# EAGLE schematic clock_datapath (EAGLE 9.6.1)
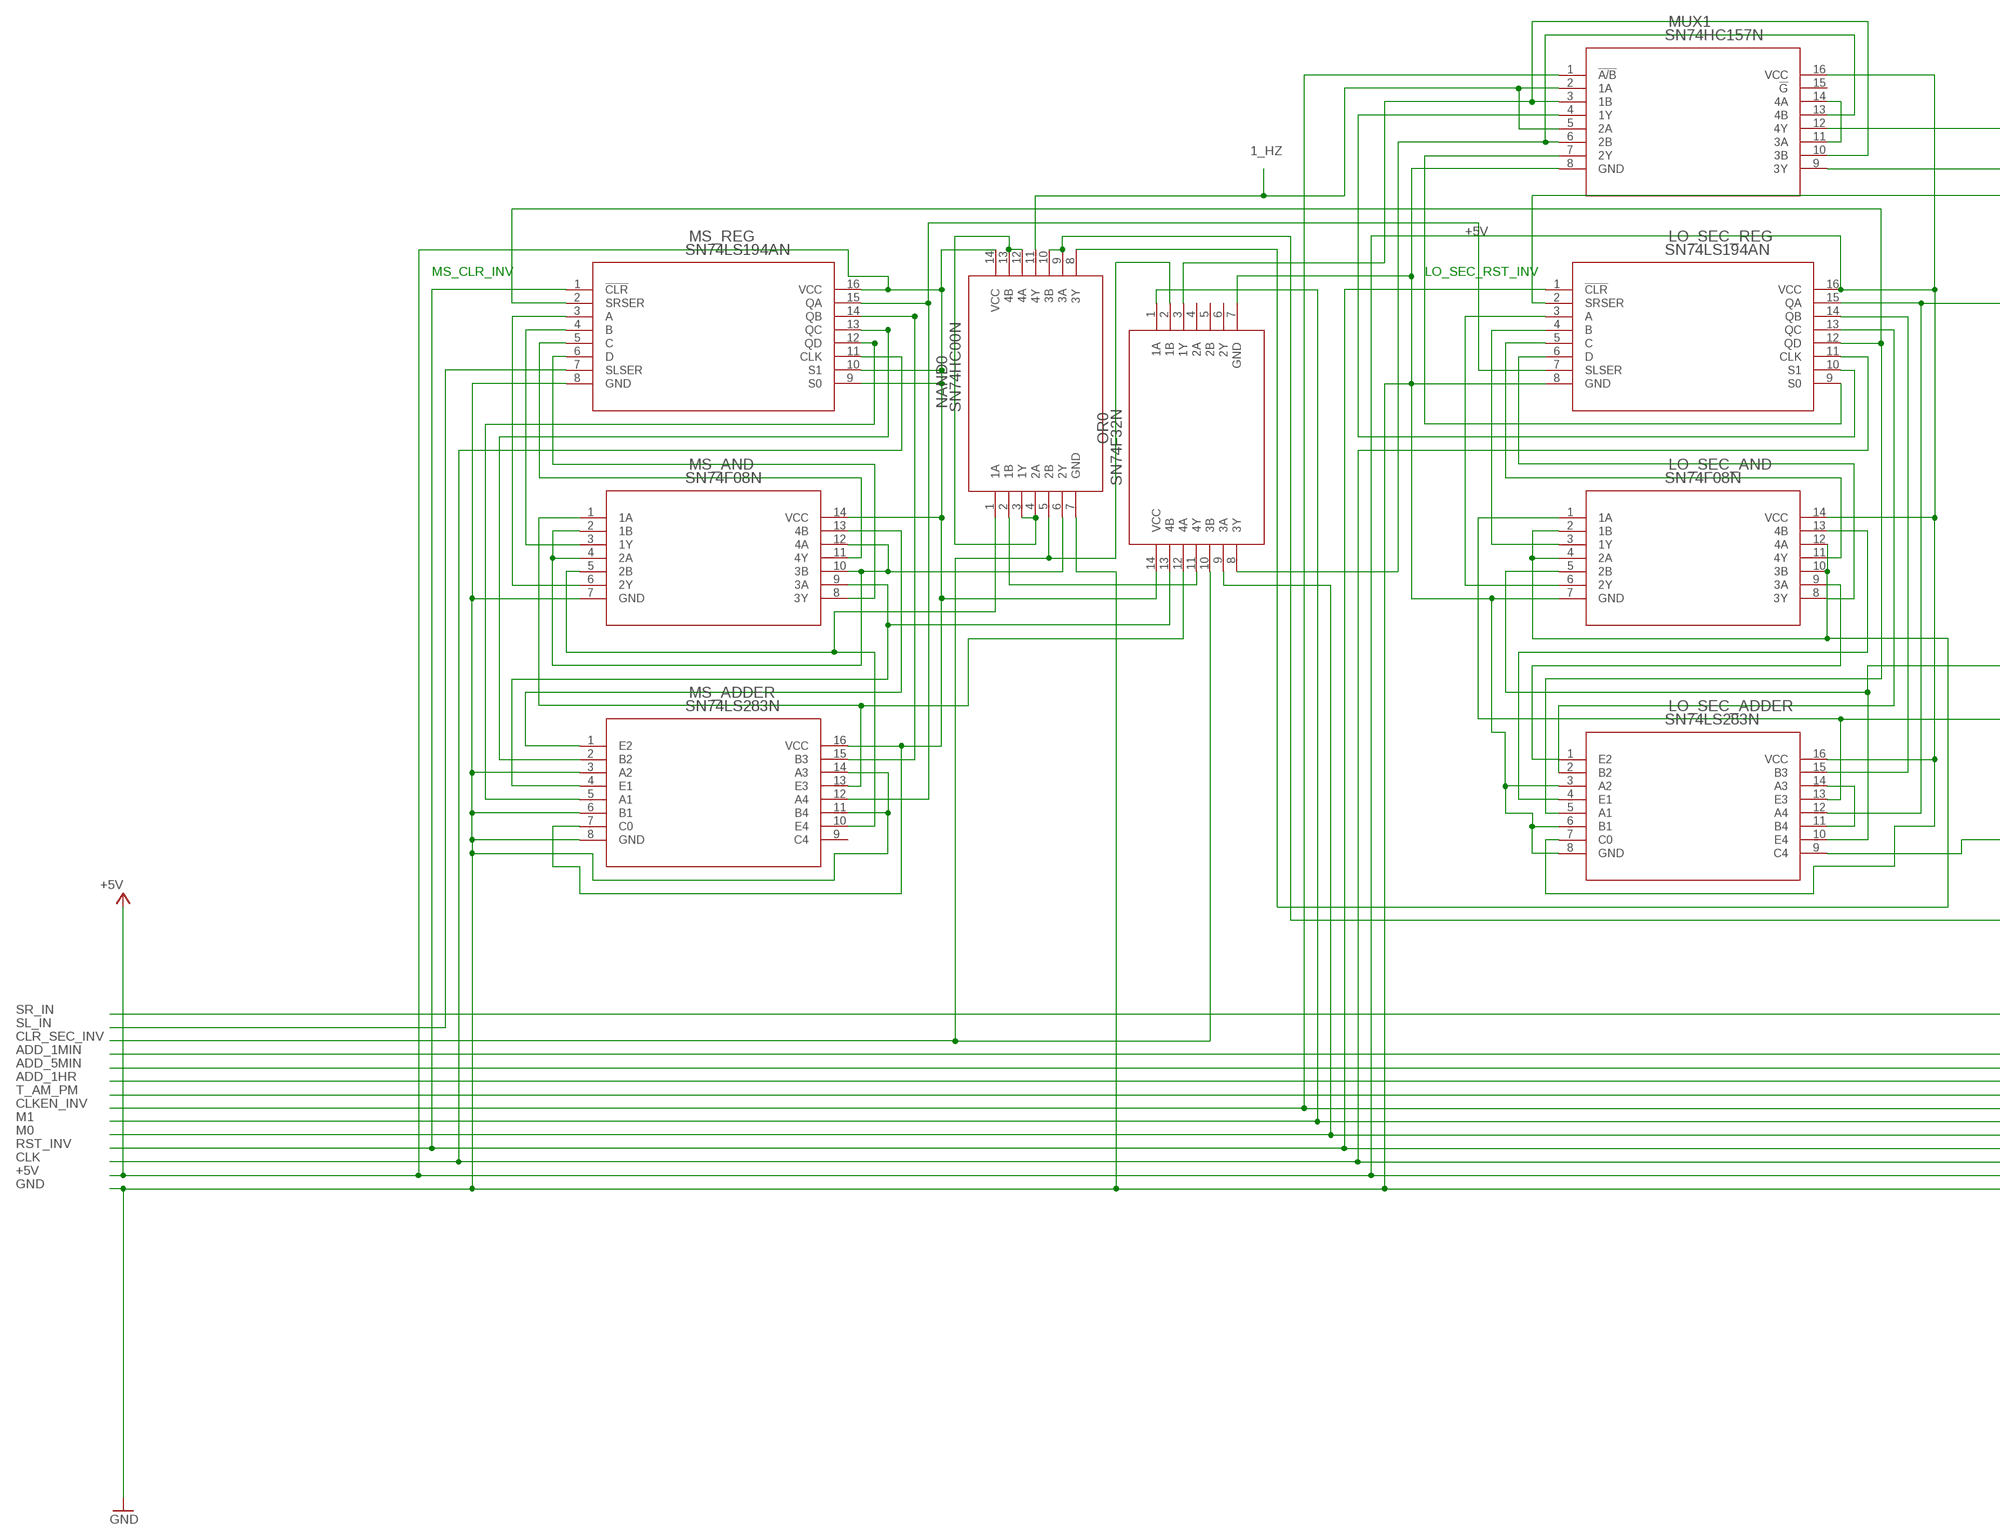
[diagram p0: schematic, sheet 1, part 1 of 3]
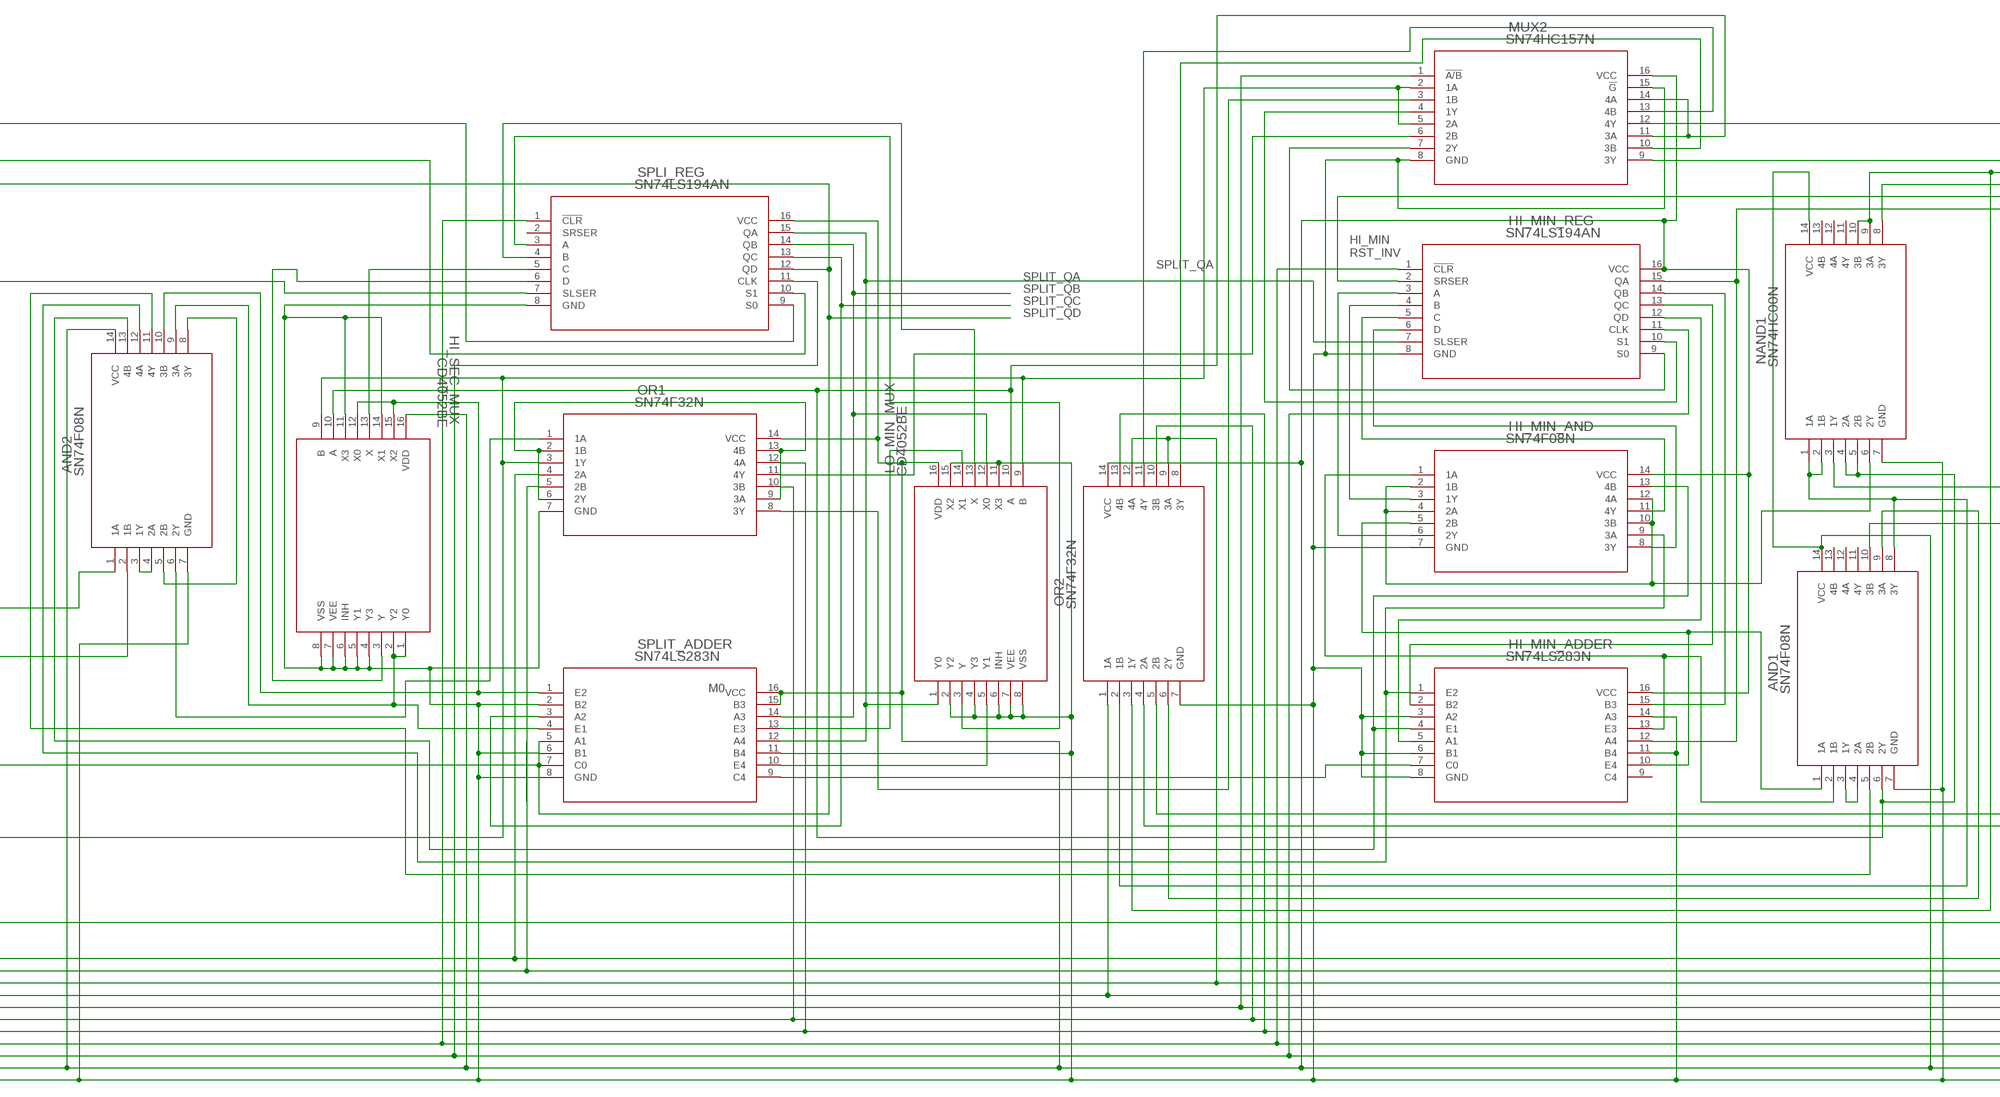
[diagram p1: schematic, sheet 1, part 2 of 3]
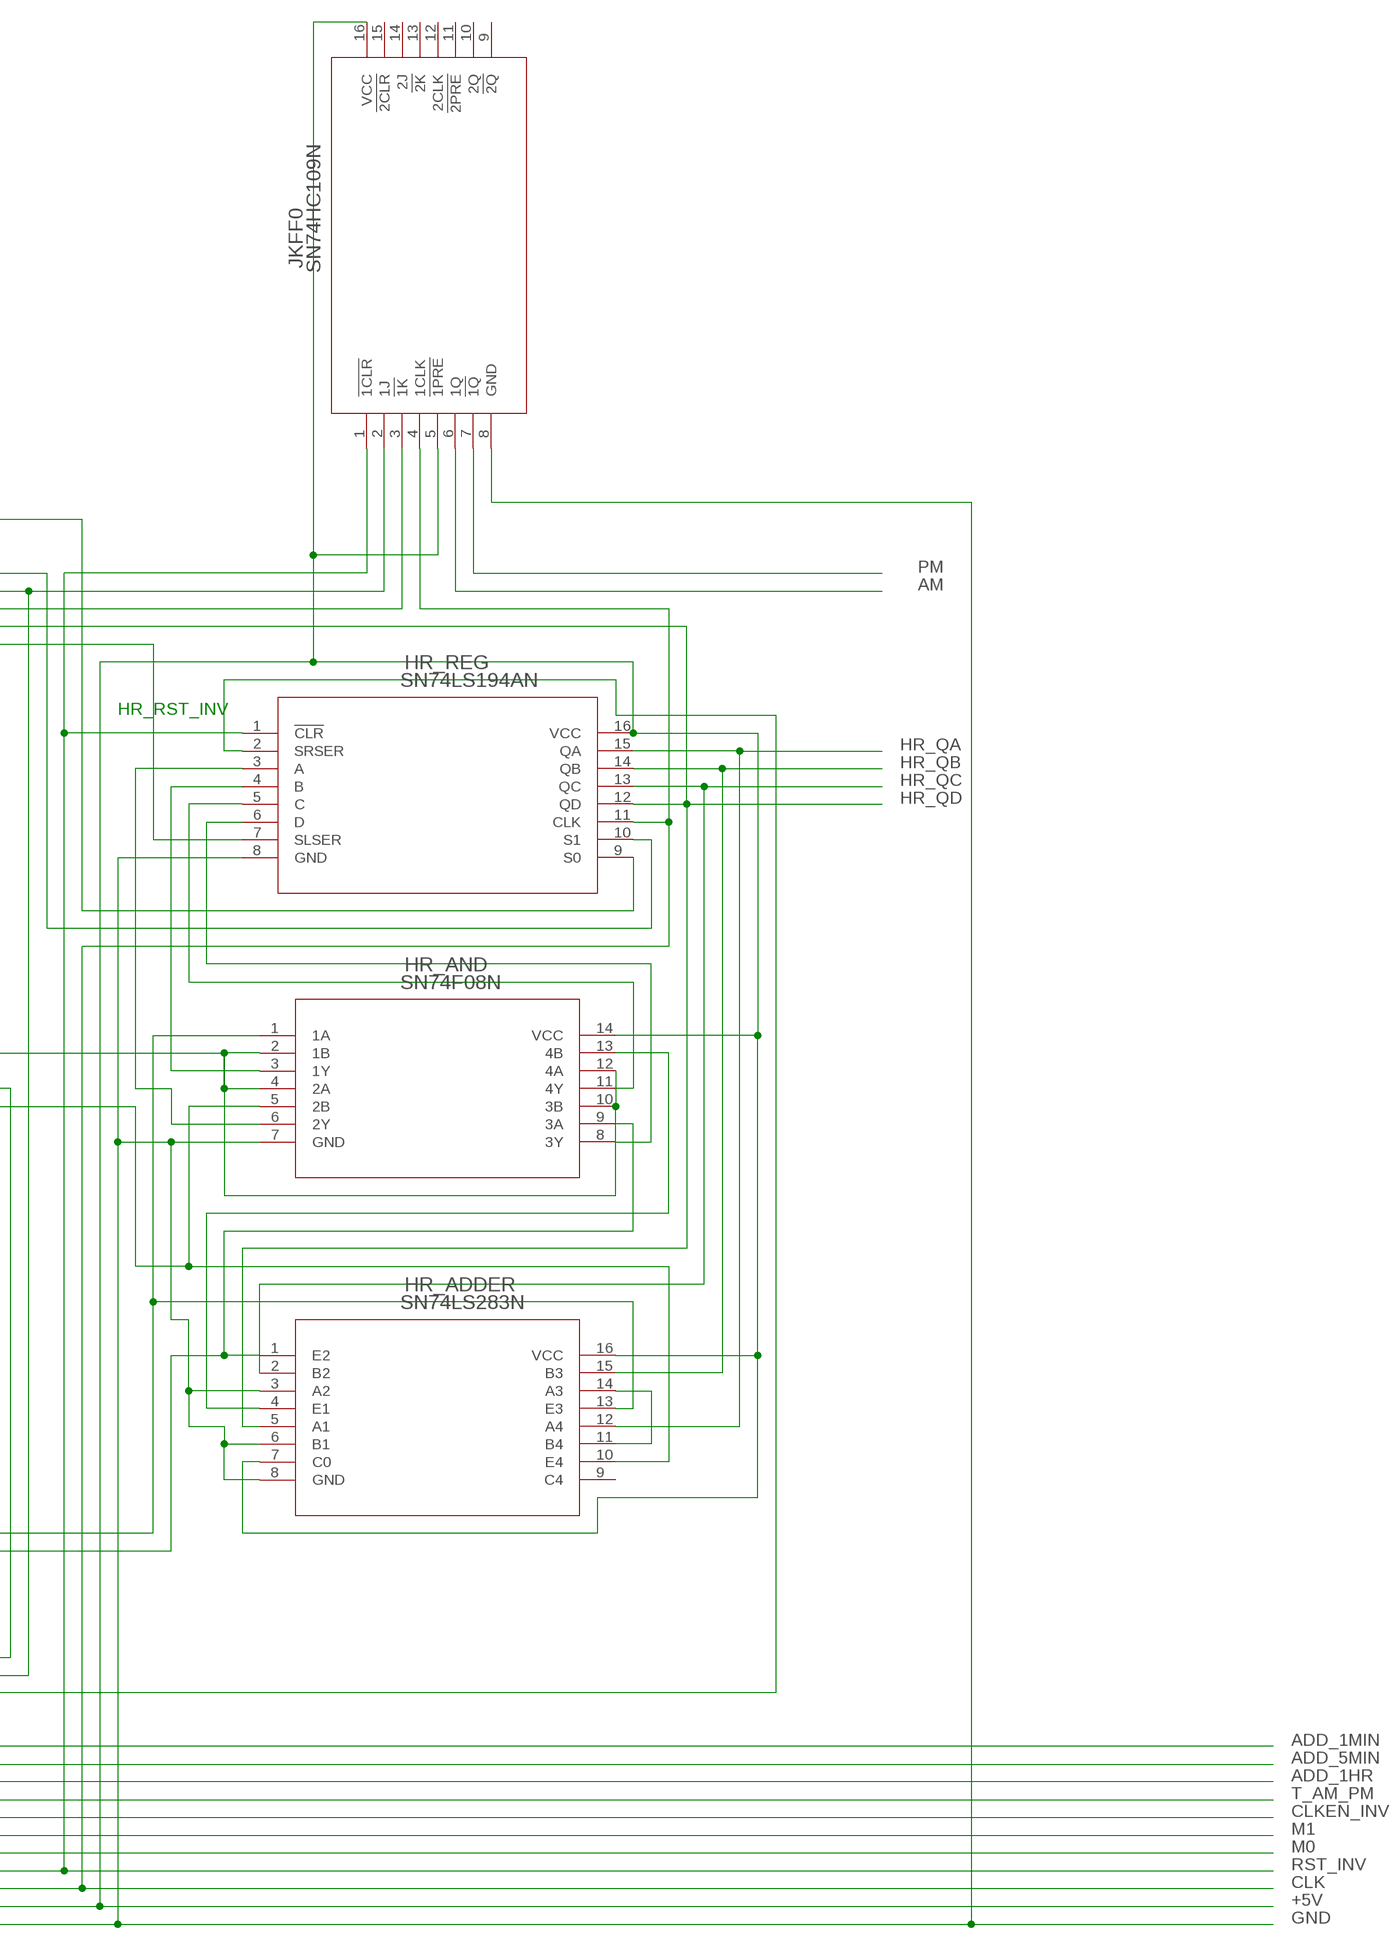
[diagram p2: schematic, sheet 1, part 3 of 3]

## Parts
AND1  SN74F08N  [N14]
AND2  SN74F08N  [N14]
HI_MIN_ADDER  SN74LS283N  [N16]
HI_MIN_AND  SN74F08N  [N14]
HI_MIN_REG  SN74LS194AN  [N16]
HI_SEC_MUX  CD4052BE  [N16]
HR_ADDER  SN74LS283N  [N16]
HR_AND  SN74F08N  [N14]
HR_REG  SN74LS194AN  [N16]
JKFF0  SN74HC109N  [N16]
LO_MIN_MUX  CD4052BE  [N16]
LO_SEC_ADDER  SN74LS283N  [N16]
LO_SEC_AND  SN74F08N  [N14]
LO_SEC_REG  SN74LS194AN  [N16]
MS_ADDER  SN74LS283N  [N16]
MS_AND  SN74F08N  [N14]
MS_REG  SN74LS194AN  [N16]
MUX1  SN74HC157N  [N16]
MUX2  SN74HC157N  [N16]
NAND0  SN74HC00N  [N14]
NAND1  SN74HC00N  [N14]
OR0  SN74F32N  [N14]
OR1  SN74F32N  [N14]
OR2  SN74F32N  [N14]
SPLI_REG  SN74LS194AN  [N16]
SPLIT_ADDER  SN74LS283N  [N16]

## Nets
1_HZ: MUX1.2(1A) MUX1.5(2A) NAND0.11(4Y)
+5V: AND1.14(VCC) AND2.14(VCC) HI_MIN_ADDER.16(VCC) HI_MIN_AND.14(VCC) HI_MIN_REG.16(VCC) HI_SEC_MUX.16(VDD) HR_ADDER.7(C0) HR_ADDER.16(VCC) HR_AND.14(VCC) HR_REG.16(VCC) JKFF0.5(!1PRE) JKFF0.16(VCC) LO_MIN_MUX.16(VDD) LO_SEC_ADDER.7(C0) LO_SEC_ADDER.16(VCC) LO_SEC_AND.14(VCC) LO_SEC_REG.16(VCC) MS_ADDER.7(C0) MS_ADDER.16(VCC) MS_AND.14(VCC) MS_REG.9(S0) MS_REG.10(S1) MS_REG.16(VCC) MUX1.16(VCC) MUX2.16(VCC) NAND0.14(VCC) NAND1.14(VCC) OR0.14(VCC) OR1.14(VCC) OR2.14(VCC) SPLI_REG.16(VCC) SPLIT_ADDER.15(B3) SPLIT_ADDER.16(VCC)
ADD_1HR: OR2.9(3A) OR2.12(4A)
ADD_1MIN: OR1.4(2A)
ADD_5MIN: OR1.5(2B)
AM: JKFF0.6(1Q)
CLK: HI_MIN_REG.11(CLK) HR_REG.11(CLK) JKFF0.4(1CLK) LO_SEC_REG.11(CLK) MS_REG.11(CLK) SPLI_REG.11(CLK)
CLKEN_INV: MUX1.1(!A/B) MUX2.1(!A/B)
CLR_SEC_INV: NAND0.5(2B) OR0.2(1B) OR0.10(3B)
GND: AND1.7(GND) AND2.7(GND) HI_MIN_ADDER.3(A2) HI_MIN_ADDER.6(B1) HI_MIN_ADDER.8(GND) HI_MIN_ADDER.11(B4) HI_MIN_ADDER.14(A3) HI_MIN_AND.7(GND) HI_MIN_REG.8(GND) HI_SEC_MUX.4(Y3) HI_SEC_MUX.5(Y1) HI_SEC_MUX.6(INH) HI_SEC_MUX.7(VEE) HI_SEC_MUX.8(VSS) HI_SEC_MUX.11(X3) HI_SEC_MUX.14(X1) HR_ADDER.3(A2) HR_ADDER.6(B1) HR_ADDER.8(GND) HR_AND.7(GND) HR_REG.8(GND) JKFF0.8(GND) LO_MIN_MUX.2(Y2) LO_MIN_MUX.4(Y3) LO_MIN_MUX.6(INH) LO_MIN_MUX.7(VEE) LO_MIN_MUX.8(VSS) LO_MIN_MUX.11(X3) LO_MIN_MUX.15(X2) LO_SEC_ADDER.3(A2) LO_SEC_ADDER.6(B1) LO_SEC_ADDER.8(GND) LO_SEC_AND.7(GND) LO_SEC_REG.8(GND) MS_ADDER.3(A2) MS_ADDER.6(B1) MS_ADDER.8(GND) MS_ADDER.11(B4) MS_ADDER.14(A3) MS_AND.7(GND) MS_REG.8(GND) MUX1.8(GND) MUX2.8(GND) MUX2.15(!G) NAND0.7(GND) NAND1.7(GND) OR0.7(GND) OR1.7(GND) OR2.7(GND) SPLI_REG.8(GND) SPLIT_ADDER.2(B2) SPLIT_ADDER.6(B1) SPLIT_ADDER.8(GND) SPLIT_ADDER.11(B4)
HI_MIN_ADD_2: AND1.2(1B) HI_MIN_ADDER.13(E3) HI_MIN_AND.1(1A)
HI_MIN_ADD_!: AND2.12(4A) HI_MIN_ADDER.1(E2) HI_MIN_AND.9(3A)
HI_MIN_ADD_MSB: AND1.1(1A) HI_MIN_ADDER.10(E4) HI_MIN_AND.5(2B)
HI_MIN_QA: HI_MIN_ADDER.12(A4) HI_MIN_REG.15(QA) HR_REG.7(SLSER)
HI_MIN_QB: HI_MIN_ADDER.15(B3) HI_MIN_REG.14(QB)
HI_MIN_QC: HI_MIN_ADDER.2(B2) HI_MIN_REG.13(QC)
HI_MIN_QD: HI_MIN_ADDER.5(A1) HI_MIN_REG.12(QD)
HI_MIN_RST_INV: HI_MIN_AND.2(1B) HI_MIN_AND.4(2A) HI_MIN_AND.10(3B) HI_MIN_AND.12(4A) NAND1.6(2Y)
HI_MIN_S0: HI_MIN_REG.9(S0) MUX2.7(2Y)
HI_MIN_S1: HI_MIN_REG.10(S1) MUX2.4(1Y)
HR_ADD_1: HR_ADDER.1(E2) HR_AND.9(3A) OR2.4(2A)
HR_ADD_2: HR_ADDER.13(E3) HR_AND.1(1A) OR2.5(2B)
HR_ADD_MSB: AND1.10(3B) HR_ADDER.10(E4) HR_AND.5(2B)
HR_QA: HR_ADDER.12(A4) HR_REG.15(QA)
HR_QB: HR_ADDER.15(B3) HR_REG.14(QB)
HR_QC: HR_ADDER.2(B2) HR_REG.13(QC)
HR_QD: HI_MIN_REG.2(SRSER) HR_ADDER.5(A1) HR_REG.12(QD)
HR_RST_INV: HR_AND.2(1B) HR_AND.4(2A) HR_AND.10(3B) HR_AND.12(4A) NAND1.3(1Y)
HR_S0: HR_REG.9(S0) MUX2.12(4Y)
HR_S1: HR_REG.10(S1) MUX2.9(3Y)
LO_SEC_ADD_1: LO_SEC_ADDER.1(E2) LO_SEC_AND.9(3A)
LO_SEC_ADD_2: AND2.2(1B) LO_SEC_ADDER.13(E3) LO_SEC_AND.1(1A)
LO_SEC_M1: MUX1.3(1B) MUX1.10(3B) OR0.3(1Y)
LO_SEC_M2: MUX1.6(2B) MUX1.13(4B) OR0.8(3Y)
LO_SEC_QA: LO_SEC_ADDER.12(A4) LO_SEC_REG.15(QA) SPLI_REG.7(SLSER)
LO_SEC_QB: LO_SEC_ADDER.15(B3) LO_SEC_REG.14(QB)
LO_SEC_QC: LO_SEC_ADDER.2(B2) LO_SEC_REG.13(QC)
LO_SEC_QD: LO_SEC_ADDER.5(A1) LO_SEC_REG.12(QD) MS_REG.2(SRSER)
LO_SEC_RST_INV: LO_SEC_AND.2(1B) LO_SEC_AND.4(2A) LO_SEC_AND.10(3B) LO_SEC_AND.12(4A) NAND0.8(3Y)
LO_SEC_S0: LO_SEC_REG.9(S0) MUX1.7(2Y)
LO_SEC_S1: LO_SEC_REG.10(S1) MUX1.4(1Y)
M0: OR0.9(3A) OR1.12(4A) OR2.13(4B)
M1: OR0.1(1A) OR1.10(3B) OR2.10(3B)
MS_ADD_1: MS_ADDER.13(E3) MS_AND.1(1A) OR0.12(4A)
MS_ADD_2: MS_ADDER.4(E1) MS_AND.9(3A) OR0.13(4B)
MS_ADD_MSB: MS_ADDER.10(E4) MS_AND.5(2B) NAND0.1(1A)
MS_QA: LO_SEC_REG.7(SLSER) MS_ADDER.12(A4) MS_REG.15(QA)
MS_QB: MS_ADDER.15(B3) MS_REG.14(QB)
MS_QC: MS_ADDER.2(B2) MS_REG.13(QC)
MS_QD: MS_ADDER.5(A1) MS_REG.12(QD)
MS_RST_INV: MS_AND.2(1B) MS_AND.4(2A) MS_AND.10(3B) MS_AND.12(4A) NAND0.6(2Y)
MVOE: LO_MIN_MUX.14(X1) SPLIT_ADDER.13(E3)
N$1: HR_AND.6(2Y) HR_REG.3(A)
N$2: HR_AND.3(1Y) HR_REG.4(B)
N$3: HR_AND.11(4Y) HR_REG.5(C)
N$4: HR_AND.8(3Y) HR_REG.6(D)
N$5: HR_ADDER.4(E1) HR_AND.13(4B)
N$6: MS_AND.6(2Y) MS_REG.3(A)
N$7: MS_AND.3(1Y) MS_REG.4(B)
N$8: MS_AND.11(4Y) MS_REG.5(C)
N$9: MS_AND.8(3Y) MS_REG.6(D)
N$10: MS_ADDER.1(E2) MS_AND.13(4B)
N$11: NAND0.2(1B) OR0.11(4Y)
N$12: LO_SEC_AND.6(2Y) LO_SEC_REG.3(A)
N$13: LO_SEC_AND.3(1Y) LO_SEC_REG.4(B)
N$14: HR_ADDER.11(B4) HR_ADDER.14(A3)
N$15: LO_SEC_AND.11(4Y) LO_SEC_REG.5(C)
N$16: LO_SEC_AND.8(3Y) LO_SEC_REG.6(D)
N$17: LO_SEC_ADDER.4(E1) LO_SEC_AND.13(4B)
N$18: LO_SEC_ADDER.11(B4) LO_SEC_ADDER.14(A3)
N$19: HI_MIN_AND.6(2Y) HI_MIN_REG.3(A)
N$20: HI_MIN_AND.3(1Y) HI_MIN_REG.4(B)
N$21: HI_MIN_AND.11(4Y) HI_MIN_REG.5(C)
N$22: HI_MIN_AND.8(3Y) HI_MIN_REG.6(D)
N$23: AND2.13(4B) HI_MIN_ADDER.4(E1) HI_MIN_AND.13(4B)
N$25: MUX1.9(3Y) SPLI_REG.10(S1)
N$26: MUX1.12(4Y) SPLI_REG.9(S0)
N$28: MUX1.11(3A) MUX1.14(4A)
N$29: HI_MIN_ADDER.7(C0) SPLIT_ADDER.9(C4)
N$30: HI_SEC_MUX.3(Y) SPLI_REG.6(D)
N$31: AND1.9(3A) OR2.6(2Y)
N$32: LO_MIN_MUX.3(Y) SPLI_REG.3(A)
N$34: AND1.5(2B) AND2.11(4Y)
N$35: MUX2.13(4B) OR2.11(4Y)
N$36: AND2.5(2B) AND2.8(3Y)
N$37: AND2.6(2Y) OR1.1(1A)
N$38: HI_SEC_MUX.9(B) LO_MIN_MUX.9(B) MUX2.2(1A) MUX2.5(2A) NAND0.9(3A) NAND0.10(3B) OR1.3(1Y)
N$39: OR1.2(1B) OR1.6(2Y) OR1.9(3A) OR1.13(4B)
N$40: AND2.9(3A) HI_SEC_MUX.1(Y0) HI_SEC_MUX.2(Y2) SPLIT_ADDER.4(E1)
N$41: AND2.10(3B) HI_SEC_MUX.12(X0) HI_SEC_MUX.15(X2) SPLIT_ADDER.1(E2)
N$42: HI_SEC_MUX.13(X) SPLI_REG.5(C)
N$43: LO_MIN_MUX.13(X) SPLI_REG.4(B)
N$44: LO_MIN_MUX.5(Y1) SPLIT_ADDER.10(E4)
N$45: MUX2.10(3B) OR2.8(3Y)
N$47: AND1.3(1Y) AND1.4(2A)
N$48: NAND0.3(1Y) NAND0.4(2A) NAND0.12(4A) NAND0.13(4B)
N$50: AND1.6(2Y) HI_SEC_MUX.10(A) LO_MIN_MUX.10(A) MUX2.11(3A) MUX2.14(4A) NAND1.4(2A) NAND1.5(2B)
N$51: MUX2.3(1B) OR1.8(3Y)
N$52: MUX2.6(2B) OR1.11(4Y)
N$53: AND2.3(1Y) AND2.4(2A)
N$54: AND1.8(3Y) NAND1.1(1A) NAND1.2(1B) OR2.2(1B)
N$55: AND2.1(1A) LO_SEC_ADDER.10(E4) LO_SEC_AND.5(2B)
N$57: JKFF0.2(1J) NAND1.9(3A) NAND1.10(3B) OR2.3(1Y)
N$58: JKFF0.3(!1K) NAND1.8(3Y)
PM: JKFF0.7(!1Q)
RST_INV: HI_MIN_REG.1(!CLR) HR_REG.1(!CLR) JKFF0.1(!1CLR) LO_SEC_REG.1(!CLR) MS_REG.1(!CLR) SPLI_REG.1(!CLR)
SL_IN: MS_REG.7(SLSER)
SPLIT_QA: HI_MIN_REG.7(SLSER) LO_MIN_MUX.1(Y0) SPLI_REG.15(QA) SPLIT_ADDER.12(A4)
SPLIT_QB: LO_MIN_MUX.12(X0) SPLI_REG.14(QB) SPLIT_ADDER.14(A3)
SPLIT_QC: SPLI_REG.13(QC) SPLIT_ADDER.3(A2)
SPLIT_QD: LO_SEC_ADDER.9(C4) LO_SEC_REG.2(SRSER) SPLI_REG.12(QD) SPLIT_ADDER.5(A1) SPLIT_ADDER.7(C0)
SR_IN: HR_REG.2(SRSER)
T_AM_PM: OR2.1(1A)
Unconnected: AND1.11(4Y) AND1.12(4A) AND1.13(4B) HI_MIN_ADDER.9(C4) HR_ADDER.9(C4) JKFF0.9(!2Q) JKFF0.10(2Q) JKFF0.11(!2PRE) JKFF0.12(2CLK) JKFF0.13(!2K) JKFF0.14(2J) JKFF0.15(!2CLR) MS_ADDER.9(C4) MUX1.15(!G) NAND1.11(4Y) NAND1.12(4A) NAND1.13(4B) OR0.4(2A) OR0.5(2B) OR0.6(2Y) SPLI_REG.2(SRSER)

## Notes on the sheet
- MS_CLR_INV | LO_SEC_RST_INV
- HI_MIN
  RST_INV
- HR_RST_INV

## Library data of the parts
AND1 AND2 HI_MIN_AND HR_AND LO_SEC_AND MS_AND = sn74f08n:SN74F08N: Quad 2-In Positive AND; DATASHEET_URL: http://www.ti.com/lit/gpn/SN74F08; DESCRIPTION: Quadruple 2-Input Positive-AND Gate; FAMILY_NAME: AND GATE; GENERIC_PART_NUMBER: SN74F08; INDUSTRY_STD_PKG_TYPE: PDIP; MANUFACTURER: Texas Instruments; PACKAGE_DESIGNATOR: N; PIN_COUNT: 14
HI_MIN_ADDER HR_ADDER LO_SEC_ADDER MS_ADDER SPLIT_ADDER = sn74ls283n:SN74LS283N: 4-Bit Full Adder w/ Fast Carry; DATASHEET_URL: http://www.ti.com/lit/gpn/SN74LS283; DESCRIPTION: 4-Bit Binary Full Adders With Fast Carry; FAMILY_NAME: ADDER; GENERIC_PART_NUMBER: SN74LS283; INDUSTRY_STD_PKG_TYPE: PDIP; MANUFACTURER: Texas Instruments; PACKAGE_DESIGNATOR: N; PIN_COUNT: 16
HI_MIN_REG HR_REG LO_SEC_REG MS_REG SPLI_REG = sn74ls194an:SN74LS194AN: 4-Bit BiDir. Universal Shift Register; DATASHEET_URL: http://www.ti.com/lit/gpn/SN74LS194A; DESCRIPTION: Bidirectional universal shift registers; FAMILY_NAME: SHIFT REGISTER; GENERIC_PART_NUMBER: SN74LS194A; INDUSTRY_STD_PKG_TYPE: PDIP; MANUFACTURER: Texas Instruments; PACKAGE_DESIGNATOR: N; PIN_COUNT: 16
HI_SEC_MUX LO_MIN_MUX = cd4052be:CD4052BE: 4:1 Dual-Channel General MUX; DATASHEET_URL: http://www.ti.com/lit/gpn/CD4052B; DESCRIPTION: CMOS Differential 4-Channel Analog Multiplexer/Demultiplexer with Logic-Level Conversion; FAMILY_NAME: ANALOG SWITCH/MULTIPLEXER (greater than 5V); GENERIC_PART_NUMBER: CD4052B; INDUSTRY_STD_PKG_TYPE: PDIP; MANUFACTURER: Texas Instruments; PACKAGE_DESIGNATOR: N; PIN_COUNT: 16
JKFF0 = sn74hc109n:SN74HC109N: Dual Positive JKFF w/ CLR & Preset; DATASHEET_URL: http://www.ti.com/lit/gpn/SN74HC109; DESCRIPTION: Dual J-K Positive-Edge-Triggered Flip-Flops With Clear and Preset; FAMILY_NAME: J-K FLIPFLOP; GENERIC_PART_NUMBER: SN74HC109; INDUSTRY_STD_PKG_TYPE: PDIP; MANUFACTURER: Texas Instruments; PACKAGE_DESIGNATOR: N; PIN_COUNT: 16
MUX1 MUX2 = sn74hc157n:SN74HC157N: Quad 2:1 MUX; DATASHEET_URL: http://www.ti.com/lit/gpn/SN74HC157; DESCRIPTION: Quadruple 2-Line To 1-Line Data Selectors/Multiplexers; FAMILY_NAME: DATA SELECTOR/MULTIPLEXER; GENERIC_PART_NUMBER: SN74HC157; INDUSTRY_STD_PKG_TYPE: PDIP; MANUFACTURER: Texas Instruments; PACKAGE_DESIGNATOR: N; PIN_COUNT: 16
NAND0 NAND1 = sn74hc00n:SN74HC00N: Quad 2-In Positive NAND; DATASHEET_URL: http://www.ti.com/lit/gpn/SN74HC00; DESCRIPTION: Quad 2-Input Positive-NAND Gates; FAMILY_NAME: NAND GATE; GENERIC_PART_NUMBER: SN74HC00; INDUSTRY_STD_PKG_TYPE: PDIP; MANUFACTURER: Texas Instruments; PACKAGE_DESIGNATOR: N; PIN_COUNT: 14
OR0 OR1 OR2 = sn74f32n:SN74F32N: Quad 2-In Positive OR; DATASHEET_URL: http://www.ti.com/lit/gpn/SN74F32; DESCRIPTION: Quad 2-input positive-OR gates; FAMILY_NAME: OR GATE; GENERIC_PART_NUMBER: SN74F32; INDUSTRY_STD_PKG_TYPE: PDIP; MANUFACTURER: Texas Instruments; PACKAGE_DESIGNATOR: N; PIN_COUNT: 14